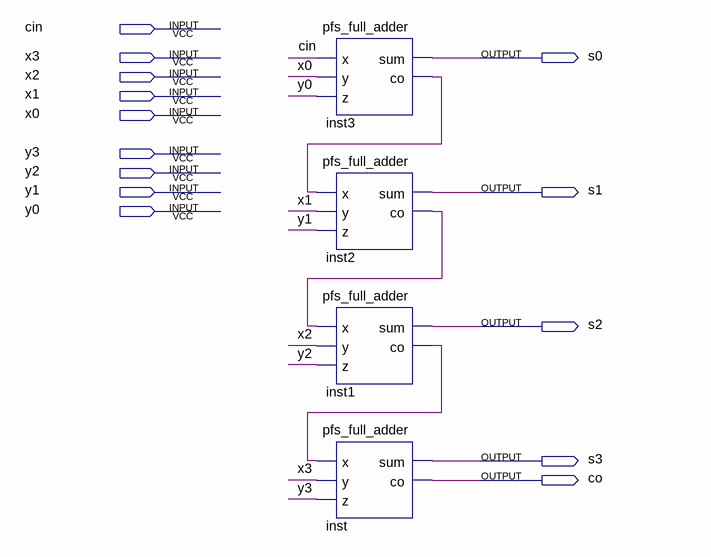
[diagram p0: schematic sheet]
// Quartus schematic pfs_sum4.bdf as structural Verilog: 4 symbols, 14 pins
module pfs_sum4 (
  input  cin,
  input  x3,
  input  x2,
  input  x1,
  input  x0,
  input  y3,
  input  y2,
  input  y1,
  input  y0,
  output s0,
  output s1,
  output s2,
  output s3,
  output co
);

  wire inst1_co, inst2_co, inst3_co;

  pfs_full_adder inst3 (.x(cin), .y(x0), .z(y0), .sum(s0), .co(inst3_co));
  pfs_full_adder inst2 (.x(inst3_co), .y(x1), .z(y1), .sum(s1), .co(inst2_co));
  pfs_full_adder inst1 (.x(inst2_co), .y(x2), .z(y2), .sum(s2), .co(inst1_co));
  pfs_full_adder inst (.x(inst1_co), .y(x3), .z(y3), .sum(s3), .co(co));
endmodule
